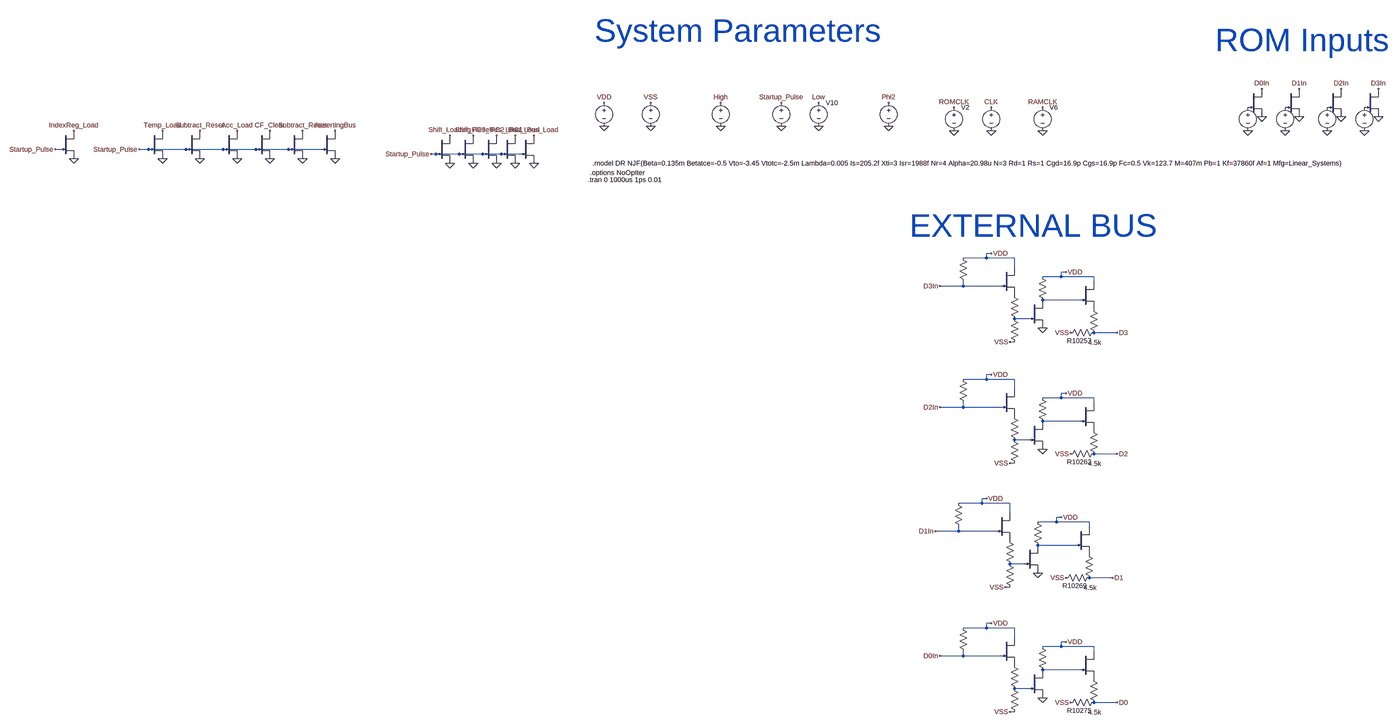
[diagram p0: schematic controls.asc, whole sheet]
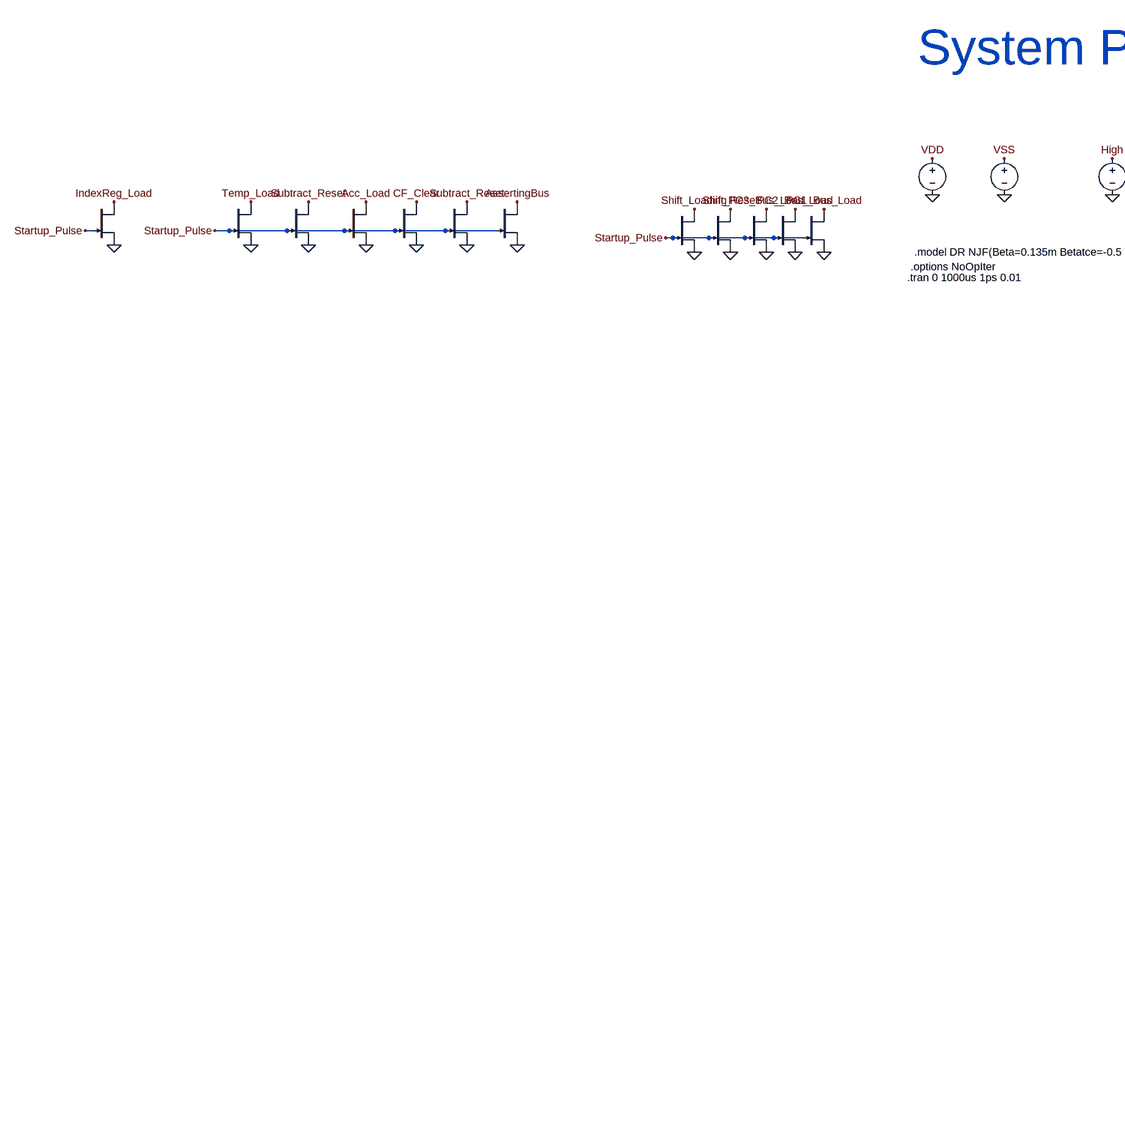
[diagram p1: schematic controls.asc, part, row 1 of 1, column 1 of 2]
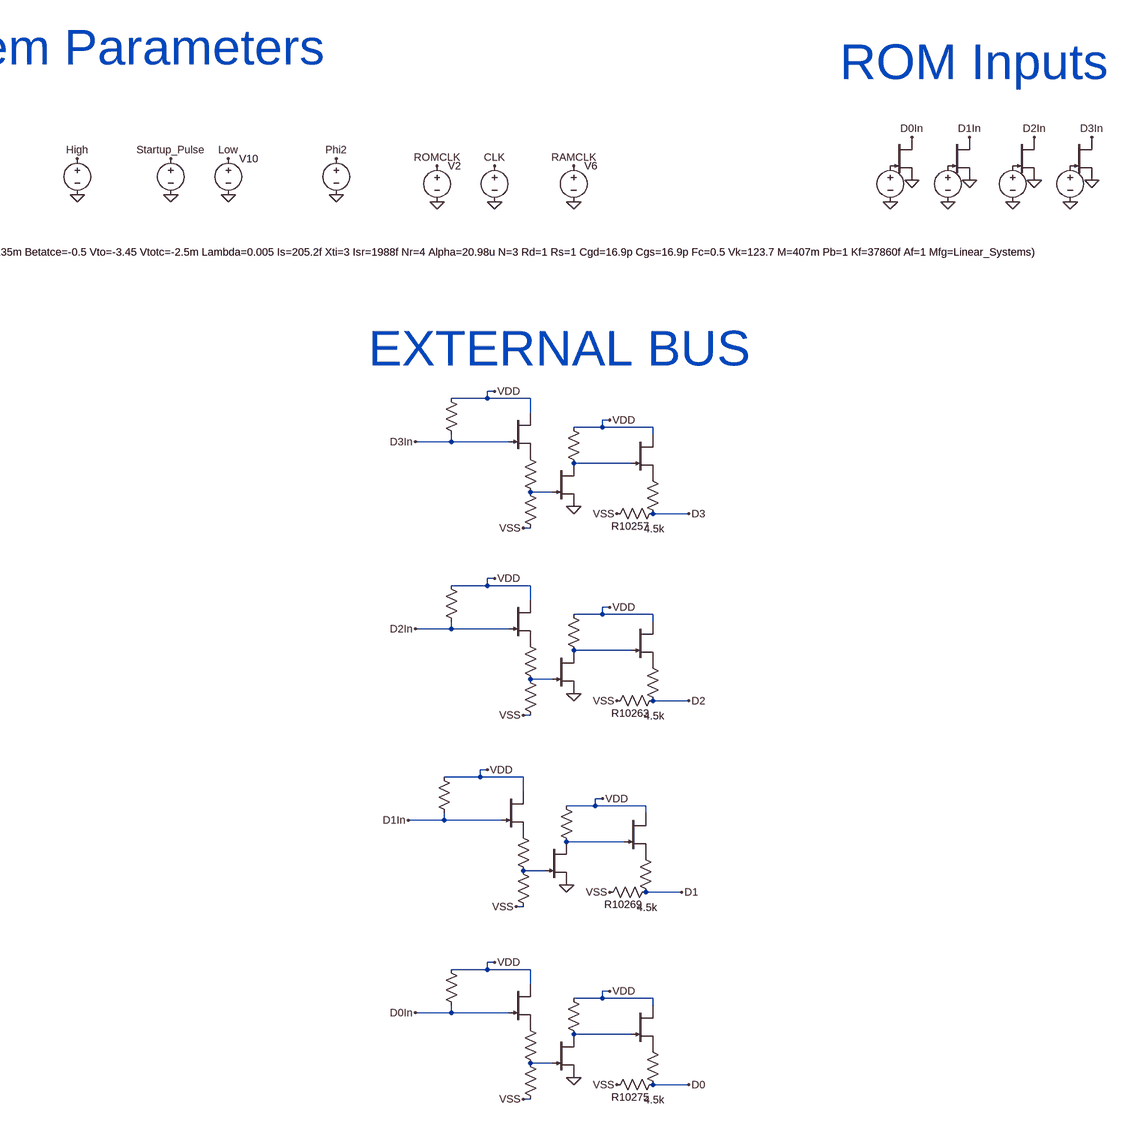
[diagram p2: schematic controls.asc, part, row 1 of 1, column 2 of 2]
controls.asc, the LTspice schematic file:
Version 4.1
SHEET 1 109444 42780
WIRE 6160 -9552 6144 -9552
WIRE 6464 -9552 6432 -9552
WIRE 6592 -9552 6464 -9552
WIRE 6720 -9552 6592 -9552
WIRE 6832 -9552 6720 -9552
WIRE 6944 -9552 6832 -9552
WIRE 7056 -9552 6944 -9552
WIRE 7488 -9536 7472 -9536
WIRE 7568 -9536 7488 -9536
WIRE 7648 -9536 7568 -9536
WIRE 7712 -9536 7648 -9536
WIRE 7776 -9536 7712 -9536
WIRE 9936 -8720 9920 -8720
WIRE 9920 -8704 9920 -8720
WIRE 9920 -8704 9840 -8704
WIRE 10016 -8704 9920 -8704
WIRE 10016 -8672 10016 -8704
WIRE 10192 -8656 10176 -8656
WIRE 10176 -8640 10176 -8656
WIRE 10176 -8640 10112 -8640
WIRE 10288 -8640 10176 -8640
WIRE 10288 -8624 10288 -8640
WIRE 9840 -8608 9840 -8624
WIRE 9840 -8608 9760 -8608
WIRE 9968 -8608 9840 -8608
WIRE 10240 -8560 10112 -8560
WIRE 10064 -8496 10016 -8496
WIRE 10368 -8448 10288 -8448
WIRE 10016 -8416 10000 -8416
WIRE 9936 -8304 9920 -8304
WIRE 9920 -8288 9920 -8304
WIRE 9920 -8288 9840 -8288
WIRE 10016 -8288 9920 -8288
WIRE 10016 -8256 10016 -8288
WIRE 10192 -8240 10176 -8240
WIRE 10176 -8224 10176 -8240
WIRE 10176 -8224 10112 -8224
WIRE 10288 -8224 10176 -8224
WIRE 10288 -8208 10288 -8224
WIRE 9840 -8192 9840 -8208
WIRE 9840 -8192 9760 -8192
WIRE 9968 -8192 9840 -8192
WIRE 10240 -8144 10112 -8144
WIRE 10064 -8080 10016 -8080
WIRE 10368 -8032 10288 -8032
WIRE 10016 -8000 10000 -8000
WIRE 9920 -7872 9904 -7872
WIRE 9904 -7856 9904 -7872
WIRE 9904 -7856 9824 -7856
WIRE 10000 -7856 9904 -7856
WIRE 10000 -7824 10000 -7856
WIRE 10176 -7808 10160 -7808
WIRE 10160 -7792 10160 -7808
WIRE 10160 -7792 10096 -7792
WIRE 10272 -7792 10160 -7792
WIRE 10272 -7776 10272 -7792
WIRE 9824 -7760 9824 -7776
WIRE 9824 -7760 9744 -7760
WIRE 9952 -7760 9824 -7760
WIRE 10224 -7712 10096 -7712
WIRE 10048 -7648 10000 -7648
WIRE 10352 -7600 10272 -7600
WIRE 10000 -7568 9984 -7568
WIRE 9936 -7424 9920 -7424
WIRE 9920 -7408 9920 -7424
WIRE 9920 -7408 9840 -7408
WIRE 10016 -7408 9920 -7408
WIRE 10016 -7376 10016 -7408
WIRE 10192 -7360 10176 -7360
WIRE 10176 -7344 10176 -7360
WIRE 10176 -7344 10112 -7344
WIRE 10288 -7344 10176 -7344
WIRE 10288 -7328 10288 -7344
WIRE 9840 -7312 9840 -7328
WIRE 9840 -7312 9760 -7312
WIRE 9968 -7312 9840 -7312
WIRE 10240 -7264 10112 -7264
WIRE 10064 -7200 10016 -7200
WIRE 10368 -7152 10288 -7152
WIRE 10016 -7120 10000 -7120
FLAG 8768 -9632 0
FLAG 8608 -9712 VDD
FLAG 8608 -9632 0
FLAG 8768 -9712 VSS
FLAG 6432 -9552 Startup_Pulse
FLAG 6512 -9616 Temp_Load
FLAG 6768 -9616 Acc_Load
FLAG 6880 -9616 CF_Clear
FLAG 6640 -9616 Subtract_Reset
FLAG 6768 -9520 0
FLAG 6512 -9520 0
FLAG 6880 -9520 0
FLAG 6640 -9520 0
FLAG 9008 -9632 0
FLAG 9008 -9712 High
FLAG 6992 -9616 Subtract_Reset
FLAG 6992 -9520 0
FLAG 7104 -9616 AssertingBus
FLAG 7104 -9520 0
FLAG 7472 -9536 Startup_Pulse
FLAG 7536 -9504 0
FLAG 7536 -9600 Shift_Loading
FLAG 7616 -9504 0
FLAG 7616 -9600 Shift_Reset
FLAG 6208 -9616 IndexReg_Load
FLAG 6144 -9552 Startup_Pulse
FLAG 6208 -9520 0
FLAG 7824 -9600 PC1_Bus_Load
FLAG 7760 -9600 PC2_Bus_Load
FLAG 7696 -9600 PC3_Bus_Load
FLAG 7696 -9504 0
FLAG 7760 -9504 0
FLAG 7824 -9504 0
FLAG 10112 -8464 0
FLAG 9936 -8720 VDD
FLAG 10192 -8656 VDD
FLAG 10000 -8416 VSS
FLAG 10208 -8448 VSS
FLAG 10112 -8048 0
FLAG 9936 -8304 VDD
FLAG 10192 -8240 VDD
FLAG 10000 -8000 VSS
FLAG 10208 -8032 VSS
FLAG 10096 -7616 0
FLAG 9920 -7872 VDD
FLAG 10176 -7808 VDD
FLAG 9984 -7568 VSS
FLAG 10192 -7600 VSS
FLAG 10112 -7168 0
FLAG 9936 -7424 VDD
FLAG 10192 -7360 VDD
FLAG 10000 -7120 VSS
FLAG 10208 -7152 VSS
FLAG 10368 -8448 D3
FLAG 10368 -8032 D2
FLAG 10352 -7600 D1
FLAG 10368 -7152 D0
FLAG 9760 -8608 D3In
FLAG 9760 -8192 D2In
FLAG 9744 -7760 D1In
FLAG 9760 -7312 D0In
FLAG 9344 -9632 0
FLAG 9344 -9712 Low
FLAG 9584 -9632 0
FLAG 9584 -9712 Phi2
FLAG 9808 -9616 0
FLAG 9808 -9696 ROMCLK
FLAG 9936 -9616 0
FLAG 9936 -9696 CLK
FLAG 10112 -9616 0
FLAG 10112 -9696 RAMCLK
FLAG 9216 -9712 Startup_Pulse
FLAG 9216 -9632 0
FLAG 10864 -9760 D0In
FLAG 10816 -9616 0
FLAG 10864 -9664 0
FLAG 10944 -9616 0
FLAG 10992 -9664 0
FLAG 10992 -9760 D1In
FLAG 11088 -9616 0
FLAG 11136 -9664 0
FLAG 11216 -9616 0
FLAG 11264 -9664 0
FLAG 11136 -9760 D2In
FLAG 11264 -9760 D3In
SYMBOL voltage 8608 -9728 R0
WINDOW 0 48 34 Invisible 2
WINDOW 3 53 69 Invisible 2
WINDOW 123 0 0 Left 0
WINDOW 39 0 0 Left 0
SYMATTR InstName V4
SYMATTR Value 24
SYMBOL voltage 8768 -9728 R0
WINDOW 123 0 0 Left 0
WINDOW 39 0 0 Left 0
WINDOW 0 37 46 Invisible 2
WINDOW 3 43 75 Invisible 2
SYMATTR InstName V5
SYMATTR Value -20
SYMBOL njf 6720 -9616 R0
WINDOW 0 19 44 Invisible 2
WINDOW 3 28 43 Invisible 2
SYMATTR InstName J_A6374
SYMATTR Value DR
SYMBOL njf 6464 -9616 R0
WINDOW 0 27 42 Invisible 2
WINDOW 3 31 43 Invisible 2
SYMATTR InstName J_A6375
SYMATTR Value DR
SYMBOL njf 6832 -9616 R0
WINDOW 0 20 138 Invisible 2
WINDOW 3 32 144 Invisible 2
SYMATTR InstName J_A6376
SYMATTR Value DR
SYMBOL njf 6592 -9616 R0
WINDOW 0 25 44 Invisible 2
WINDOW 3 29 48 Invisible 2
SYMATTR InstName J_A6377
SYMATTR Value DR
SYMBOL voltage 9008 -9728 R0
WINDOW 123 0 0 Left 0
WINDOW 39 0 0 Left 0
WINDOW 0 39 38 Invisible 2
WINDOW 3 43 75 Invisible 2
SYMATTR InstName V7
SYMATTR Value PULSE(-3.6 -800m 11u 1ns 1ns 50 50 1)
SYMBOL njf 6944 -9616 R0
WINDOW 0 21 40 Invisible 2
WINDOW 3 31 44 Invisible 2
SYMATTR InstName J_A6378
SYMATTR Value DR
SYMBOL njf 7056 -9616 R0
WINDOW 0 31 41 Invisible 2
WINDOW 3 26 43 Invisible 2
SYMATTR InstName J_A6381
SYMATTR Value DR
SYMBOL njf 7488 -9600 R0
WINDOW 0 31 155 Invisible 2
WINDOW 3 61 170 Invisible 2
SYMATTR InstName J_B2379
SYMATTR Value DR
SYMBOL njf 7568 -9600 R0
WINDOW 0 -41 157 Invisible 2
WINDOW 3 -11 163 Invisible 2
SYMATTR InstName J_B2380
SYMATTR Value DR
SYMBOL njf 6160 -9616 R0
WINDOW 0 27 44 Invisible 2
WINDOW 3 28 43 Invisible 2
SYMATTR InstName J_A6389
SYMATTR Value DR
SYMBOL njf 7648 -9600 R0
WINDOW 0 -121 172 Invisible 2
WINDOW 3 -84 167 Invisible 2
SYMATTR InstName J_A6398
SYMATTR Value DR
SYMBOL njf 7712 -9600 R0
WINDOW 0 -189 164 Invisible 2
WINDOW 3 -151 161 Invisible 2
SYMATTR InstName J_A6399
SYMATTR Value DR
SYMBOL njf 7776 -9600 R0
WINDOW 0 -232 156 Invisible 2
WINDOW 3 -205 155 Invisible 2
SYMATTR InstName J_A6400
SYMATTR Value DR
SYMBOL res 9824 -8720 R0
WINDOW 0 -35 57 Invisible 2
WINDOW 3 34 56 Invisible 2
SYMATTR InstName R10252
SYMATTR Value 100k
SYMBOL njf 9968 -8672 R0
WINDOW 0 56 32 Invisible 2
WINDOW 3 56 72 Invisible 2
SYMATTR InstName J_F2599
SYMATTR Value DR
SYMBOL res 10000 -8592 R0
WINDOW 0 -24 60 Invisible 2
WINDOW 3 34 58 Invisible 2
SYMATTR InstName R10253
SYMATTR Value 1k
SYMBOL res 10000 -8512 R0
WINDOW 0 -22 62 Invisible 2
WINDOW 3 37 62 Invisible 2
SYMATTR InstName R10254
SYMATTR Value 4.8k
SYMBOL njf 10064 -8560 R0
WINDOW 0 56 32 Invisible 2
WINDOW 3 56 72 Invisible 2
SYMATTR InstName J_A6401
SYMATTR Value DR
SYMBOL res 10096 -8656 R0
WINDOW 0 56 32 Invisible 2
WINDOW 3 56 72 Invisible 2
SYMATTR InstName R10255
SYMATTR Value 50k
SYMBOL njf 10240 -8624 R0
WINDOW 0 56 32 Invisible 2
WINDOW 3 56 72 Invisible 2
SYMATTR InstName J_A6402
SYMATTR Value DR
SYMBOL res 10272 -8544 R0
WINDOW 0 37 24 Invisible 2
WINDOW 3 -30 25 Invisible 2
SYMATTR InstName R10256
SYMATTR Value 1k
SYMBOL res 10304 -8464 R90
WINDOW 0 59 66 VBottom 2
WINDOW 3 34 13 VTop 2
SYMATTR InstName R10257
SYMATTR Value 4.5k
SYMBOL res 9824 -8304 R0
WINDOW 0 -35 57 Invisible 2
WINDOW 3 34 56 Invisible 2
SYMATTR InstName R10258
SYMATTR Value 100k
SYMBOL njf 9968 -8256 R0
WINDOW 0 56 32 Invisible 2
WINDOW 3 56 72 Invisible 2
SYMATTR InstName J_F2600
SYMATTR Value DR
SYMBOL res 10000 -8176 R0
WINDOW 0 -24 60 Invisible 2
WINDOW 3 34 58 Invisible 2
SYMATTR InstName R10259
SYMATTR Value 1k
SYMBOL res 10000 -8096 R0
WINDOW 0 -22 62 Invisible 2
WINDOW 3 37 62 Invisible 2
SYMATTR InstName R10260
SYMATTR Value 4.8k
SYMBOL njf 10064 -8144 R0
WINDOW 0 56 32 Invisible 2
WINDOW 3 56 72 Invisible 2
SYMATTR InstName J_A6403
SYMATTR Value DR
SYMBOL res 10096 -8240 R0
WINDOW 0 56 32 Invisible 2
WINDOW 3 56 72 Invisible 2
SYMATTR InstName R10261
SYMATTR Value 50k
SYMBOL njf 10240 -8208 R0
WINDOW 0 56 32 Invisible 2
WINDOW 3 56 72 Invisible 2
SYMATTR InstName J_A6404
SYMATTR Value DR
SYMBOL res 10272 -8128 R0
WINDOW 0 37 24 Invisible 2
WINDOW 3 -30 25 Invisible 2
SYMATTR InstName R10262
SYMATTR Value 1k
SYMBOL res 10304 -8048 R90
WINDOW 0 59 66 VBottom 2
WINDOW 3 34 13 VTop 2
SYMATTR InstName R10263
SYMATTR Value 4.5k
SYMBOL res 9808 -7872 R0
WINDOW 0 -35 57 Invisible 2
WINDOW 3 34 56 Invisible 2
SYMATTR InstName R10264
SYMATTR Value 100k
SYMBOL njf 9952 -7824 R0
WINDOW 0 56 32 Invisible 2
WINDOW 3 56 72 Invisible 2
SYMATTR InstName J_F2601
SYMATTR Value DR
SYMBOL res 9984 -7744 R0
WINDOW 0 -24 60 Invisible 2
WINDOW 3 34 58 Invisible 2
SYMATTR InstName R10265
SYMATTR Value 1k
SYMBOL res 9984 -7664 R0
WINDOW 0 -22 62 Invisible 2
WINDOW 3 37 62 Invisible 2
SYMATTR InstName R10266
SYMATTR Value 4.8k
SYMBOL njf 10048 -7712 R0
WINDOW 0 56 32 Invisible 2
WINDOW 3 56 72 Invisible 2
SYMATTR InstName J_A6405
SYMATTR Value DR
SYMBOL res 10080 -7808 R0
WINDOW 0 56 32 Invisible 2
WINDOW 3 56 72 Invisible 2
SYMATTR InstName R10267
SYMATTR Value 50k
SYMBOL njf 10224 -7776 R0
WINDOW 0 56 32 Invisible 2
WINDOW 3 56 72 Invisible 2
SYMATTR InstName J_A6406
SYMATTR Value DR
SYMBOL res 10256 -7696 R0
WINDOW 0 37 24 Invisible 2
WINDOW 3 -30 25 Invisible 2
SYMATTR InstName R10268
SYMATTR Value 1k
SYMBOL res 10288 -7616 R90
WINDOW 0 59 66 VBottom 2
WINDOW 3 34 13 VTop 2
SYMATTR InstName R10269
SYMATTR Value 4.5k
SYMBOL res 9824 -7424 R0
WINDOW 0 -35 57 Invisible 2
WINDOW 3 34 56 Invisible 2
SYMATTR InstName R10270
SYMATTR Value 100k
SYMBOL njf 9968 -7376 R0
WINDOW 0 56 32 Invisible 2
WINDOW 3 56 72 Invisible 2
SYMATTR InstName J_F2602
SYMATTR Value DR
SYMBOL res 10000 -7296 R0
WINDOW 0 -24 60 Invisible 2
WINDOW 3 34 58 Invisible 2
SYMATTR InstName R10271
SYMATTR Value 1k
SYMBOL res 10000 -7216 R0
WINDOW 0 -22 62 Invisible 2
WINDOW 3 37 62 Invisible 2
SYMATTR InstName R10272
SYMATTR Value 4.8k
SYMBOL njf 10064 -7264 R0
WINDOW 0 56 32 Invisible 2
WINDOW 3 56 72 Invisible 2
SYMATTR InstName J_A6407
SYMATTR Value DR
SYMBOL res 10096 -7360 R0
WINDOW 0 56 32 Invisible 2
WINDOW 3 56 72 Invisible 2
SYMATTR InstName R10273
SYMATTR Value 50k
SYMBOL njf 10240 -7328 R0
WINDOW 0 56 32 Invisible 2
WINDOW 3 56 72 Invisible 2
SYMATTR InstName J_A6408
SYMATTR Value DR
SYMBOL res 10272 -7248 R0
WINDOW 0 37 24 Invisible 2
WINDOW 3 -30 25 Invisible 2
SYMATTR InstName R10274
SYMATTR Value 1k
SYMBOL res 10304 -7168 R90
WINDOW 0 59 66 VBottom 2
WINDOW 3 34 13 VTop 2
SYMATTR InstName R10275
SYMATTR Value 4.5k
SYMBOL voltage 9344 -9728 R0
WINDOW 3 24 96 Invisible 2
WINDOW 123 0 0 Left 0
WINDOW 39 0 0 Left 0
SYMATTR Value PULSE(-800m -3.6 0 1n 1n 50 50 1)
SYMATTR InstName V10
SYMBOL voltage 9584 -9728 R0
WINDOW 123 0 0 Left 0
WINDOW 39 0 0 Left 0
WINDOW 0 39 38 Invisible 2
WINDOW 3 43 75 Invisible 2
SYMATTR InstName V1
SYMATTR Value PULSE(-3.6 -800m 13us 1ns 1ns 2us 10us 1)
SYMBOL voltage 9808 -9712 R0
WINDOW 123 0 0 Left 0
WINDOW 39 0 0 Left 0
WINDOW 3 24 96 Invisible 2
SYMATTR Value PULSE(-3.6 -800m 8u 1n 1n 5us 10us 0)
SYMATTR InstName V2
SYMBOL voltage 9936 -9712 R0
WINDOW 123 0 0 Left 0
WINDOW 39 0 0 Left 0
WINDOW 0 39 38 Invisible 2
WINDOW 3 43 75 Invisible 2
SYMATTR InstName V3
SYMATTR Value PULSE(-3.6 -800m 10u 1ns 1ns 5us 10us 10000000000000)
SYMBOL voltage 10112 -9712 R0
WINDOW 123 0 0 Left 0
WINDOW 39 0 0 Left 0
WINDOW 3 24 96 Invisible 2
SYMATTR Value PULSE(-3.6 -800m 12us 1n 1n 5us 10us 0)
SYMATTR InstName V6
SYMBOL voltage 9216 -9728 R0
WINDOW 123 0 0 Left 0
WINDOW 39 0 0 Left 0
WINDOW 0 39 38 Invisible 2
WINDOW 3 43 75 Invisible 2
SYMATTR InstName V8
SYMATTR Value PULSE(-3.6 -800m 6u 1ns 1ns 9us 10us 1)
SYMBOL voltage 10816 -9712 R0
WINDOW 0 56 32 Invisible 2
WINDOW 3 56 72 Invisible 2
SYMATTR InstName V_D1
SYMATTR Value PWL file=d0in.pwl
SYMBOL njf 10816 -9760 R0
WINDOW 0 31 41 Invisible 2
WINDOW 3 26 43 Invisible 2
SYMATTR InstName J_A1
SYMATTR Value DR
SYMBOL njf 10944 -9760 R0
WINDOW 0 31 41 Invisible 2
WINDOW 3 26 43 Invisible 2
SYMATTR InstName J_A2
SYMATTR Value DR
SYMBOL voltage 10944 -9712 R0
WINDOW 0 56 32 Invisible 2
WINDOW 3 56 72 Invisible 2
WINDOW 123 0 0 Left 0
WINDOW 39 0 0 Left 0
SYMATTR InstName V_D5
SYMATTR Value PWL file=d1in.pwl
SYMBOL voltage 11088 -9712 R0
WINDOW 0 56 32 Invisible 2
WINDOW 3 56 72 Invisible 2
WINDOW 123 0 0 Left 0
WINDOW 39 0 0 Left 0
SYMATTR InstName V_D2
SYMATTR Value PWL file=d2in.pwl
SYMBOL njf 11088 -9760 R0
WINDOW 0 31 41 Invisible 2
WINDOW 3 26 43 Invisible 2
SYMATTR InstName J_A3
SYMATTR Value DR
SYMBOL njf 11216 -9760 R0
WINDOW 0 31 41 Invisible 2
WINDOW 3 26 43 Invisible 2
SYMATTR InstName J_A4
SYMATTR Value DR
SYMBOL voltage 11216 -9712 R0
WINDOW 0 56 32 Invisible 2
WINDOW 3 56 72 Invisible 2
WINDOW 123 0 0 Left 0
WINDOW 39 0 0 Left 0
SYMATTR InstName V_D6
SYMATTR Value PWL file=d3in.pwl
TEXT 8552 -9448 Left 2 !.tran 0 1000us 1ps 0.01
TEXT 8576 -9960 Left 7 ;System Parameters
TEXT 8568 -9504 Left 2 !.model DR NJF(Beta=0.135m Betatce=-0.5 Vto=-3.45 Vtotc=-2.5m Lambda=0.005 Is=205.2f Xti=3 Isr=1988f Nr=4 Alpha=20.98u N=3 Rd=1 Rs=1 Cgd=16.9p Cgs=16.9p Fc=0.5 Vk=123.7 M=407m Pb=1 Kf=37860f Af=1 Mfg=Linear_Systems)
TEXT 8560 -9472 Left 2 !.options NoOpIter
TEXT 9656 -8816 Left 7 ;EXTERNAL BUS
TEXT 10704 -9928 Left 7 ;ROM Inputs

The netlist it stands for:
* controls.asc
V4 VDD 0 24
V5 VSS 0 -20
J_A6374 Acc_Load Startup_Pulse 0 DR
J_A6375 Temp_Load Startup_Pulse 0 DR
J_A6376 CF_Clear Startup_Pulse 0 DR
J_A6377 Subtract_Reset Startup_Pulse 0 DR
V7 High 0 PULSE(-3.6 -800m 11u 1ns 1ns 50 50 1)
J_A6378 Subtract_Reset Startup_Pulse 0 DR
J_A6381 AssertingBus Startup_Pulse 0 DR
J_B2379 Shift_Loading Startup_Pulse 0 DR
J_B2380 Shift_Reset Startup_Pulse 0 DR
J_A6389 IndexReg_Load Startup_Pulse 0 DR
J_A6398 PC3_Bus_Load Startup_Pulse 0 DR
J_A6399 PC2_Bus_Load Startup_Pulse 0 DR
J_A6400 PC1_Bus_Load Startup_Pulse 0 DR
R10252 VDD D3In 100k
J_F2599 VDD D3In P001 DR
R10253 P001 N002 1k
R10254 N002 VSS 4.8k
J_A6401 N001 N002 0 DR
R10255 VDD N001 50k
J_A6402 VDD N001 P002 DR
R10256 P002 D3 1k
R10257 D3 VSS 4.5k
R10258 VDD D2In 100k
J_F2600 VDD D2In P003 DR
R10259 P003 N004 1k
R10260 N004 VSS 4.8k
J_A6403 N003 N004 0 DR
R10261 VDD N003 50k
J_A6404 VDD N003 P004 DR
R10262 P004 D2 1k
R10263 D2 VSS 4.5k
R10264 VDD D1In 100k
J_F2601 VDD D1In P005 DR
R10265 P005 N006 1k
R10266 N006 VSS 4.8k
J_A6405 N005 N006 0 DR
R10267 VDD N005 50k
J_A6406 VDD N005 P006 DR
R10268 P006 D1 1k
R10269 D1 VSS 4.5k
R10270 VDD D0In 100k
J_F2602 VDD D0In P007 DR
R10271 P007 N008 1k
R10272 N008 VSS 4.8k
J_A6407 N007 N008 0 DR
R10273 VDD N007 50k
J_A6408 VDD N007 P008 DR
R10274 P008 D0 1k
R10275 D0 VSS 4.5k
V10 Low 0 PULSE(-800m -3.6 0 1n 1n 50 50 1)
V1 Phi2 0 PULSE(-3.6 -800m 13us 1ns 1ns 2us 10us 1)
V2 ROMCLK 0 PULSE(-3.6 -800m 8u 1n 1n 5us 10us 0)
V3 CLK 0 PULSE(-3.6 -800m 10u 1ns 1ns 5us 10us 10000000000000)
V6 RAMCLK 0 PULSE(-3.6 -800m 12us 1n 1n 5us 10us 0)
V8 Startup_Pulse 0 PULSE(-3.6 -800m 6u 1ns 1ns 9us 10us 1)
V_D1 P009 0 PWL file=d0in.pwl
J_A1 D0In P009 0 DR
J_A2 D1In P010 0 DR
V_D5 P010 0 PWL file=d1in.pwl
V_D2 P011 0 PWL file=d2in.pwl
J_A3 D2In P011 0 DR
J_A4 D3In P012 0 DR
V_D6 P012 0 PWL file=d3in.pwl
.model NJF NJF
.model PJF PJF
.lib standard.jft
.tran 0 1000us 1ps 0.01
* System Parameters
.model DR NJF(Beta=0.135m Betatce=-0.5 Vto=-3.45 Vtotc=-2.5m Lambda=0.005 Is=205.2f Xti=3 Isr=1988f Nr=4 Alpha=20.98u N=3 Rd=1 Rs=1 Cgd=16.9p Cgs=16.9p Fc=0.5 Vk=123.7 M=407m Pb=1 Kf=37860f Af=1 Mfg=Linear_Systems)
.options NoOpIter
* EXTERNAL BUS
* ROM Inputs
.backanno
.end